# Altium project radxa_c200_io_board_v1.11.PrjPcb (part 7 of 8)

## Sheet 17_CAM_Connector.SchDoc: C200
size 594 x 420 mm; Page Create Date: March  8, 1995; Page Number: 17; Page Size: A2; Comment: radxa_1010; Page Count: 21; RevCode: V1.11; Doc: 17_CAM_Connector; DsnPath: D:\WMS\C200\CC122\对外\C200 V1.11.DSN; SchematicName: c200; PageName: 17_CAM_Connector; PageSize: A2; TopSchematic: True
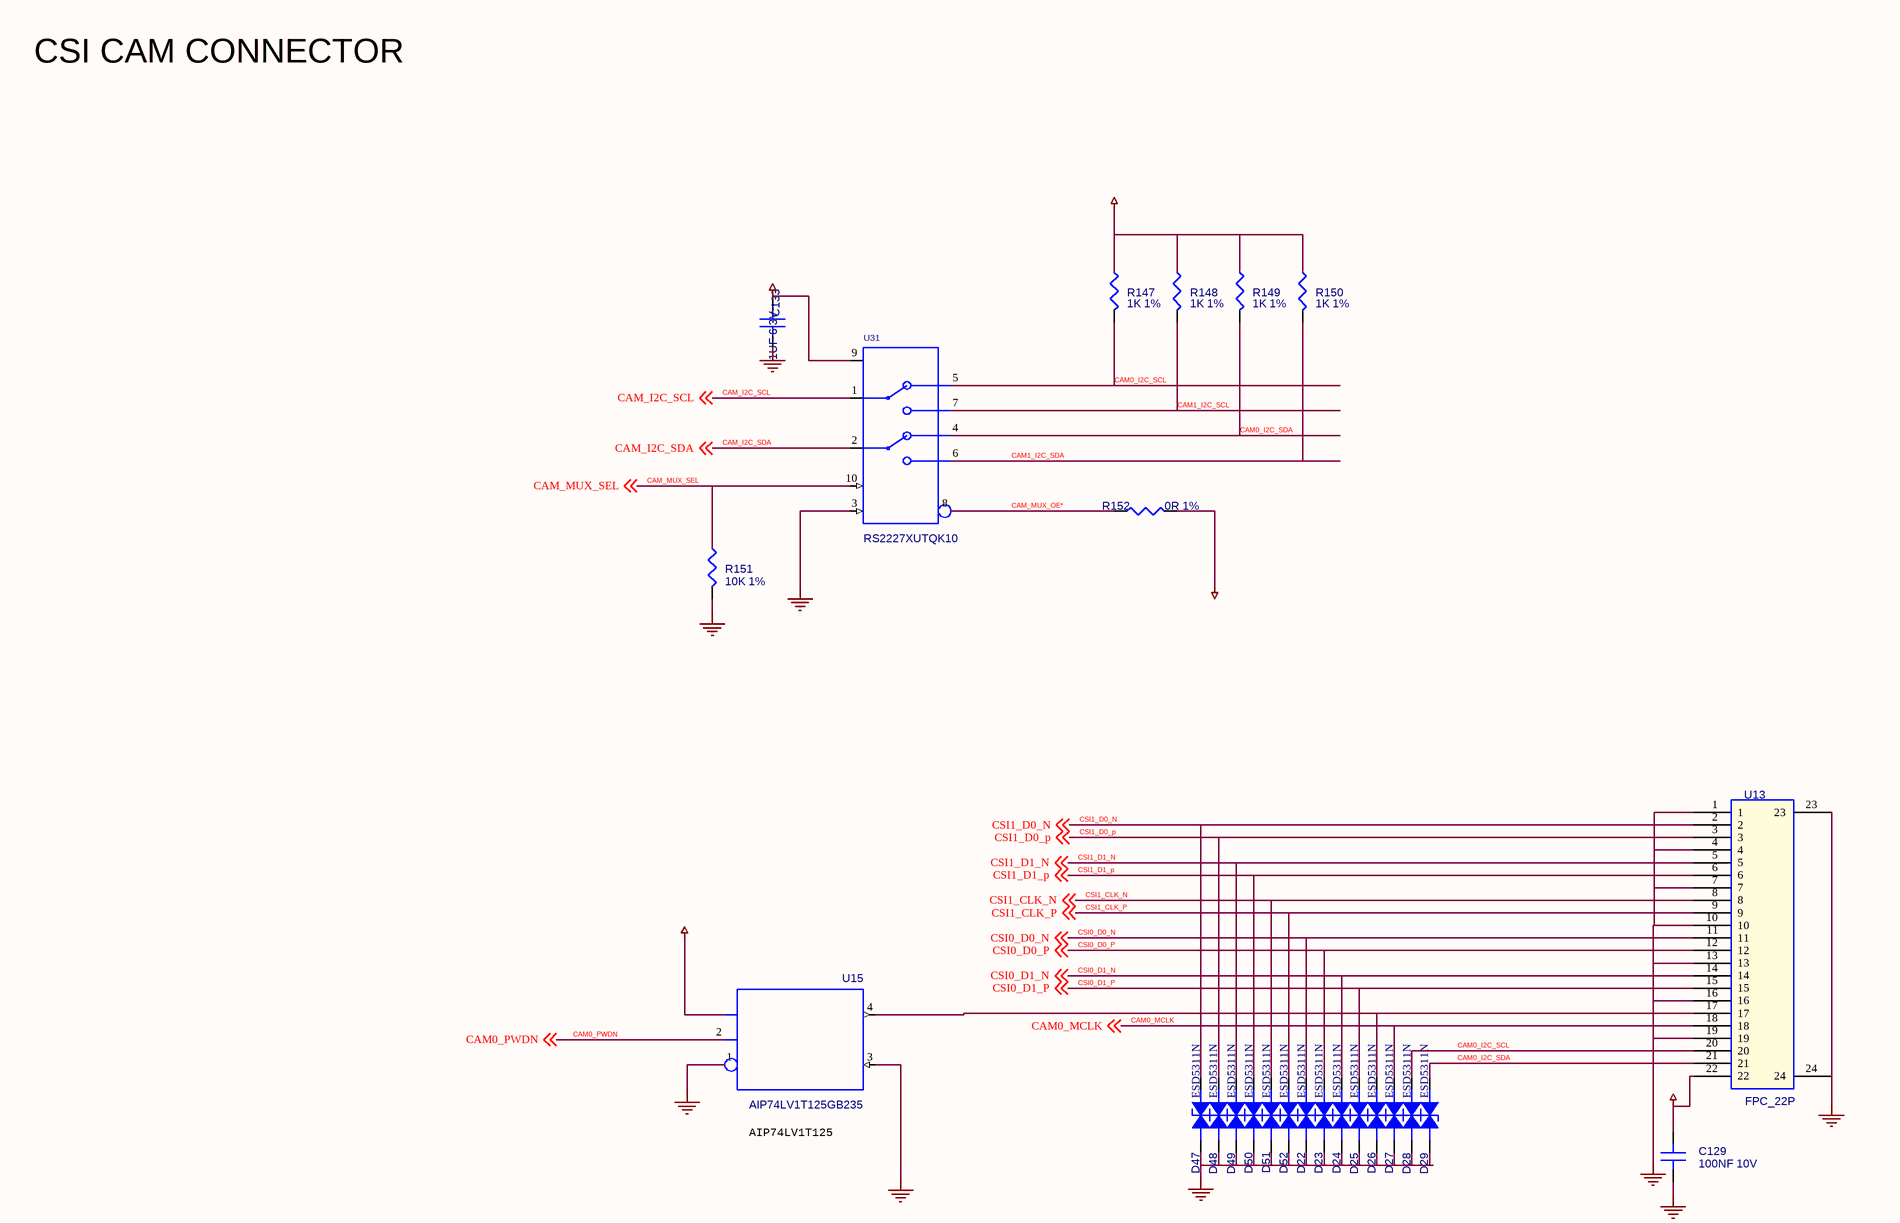
[diagram p34: 17_CAM_Connector.SchDoc, top left]
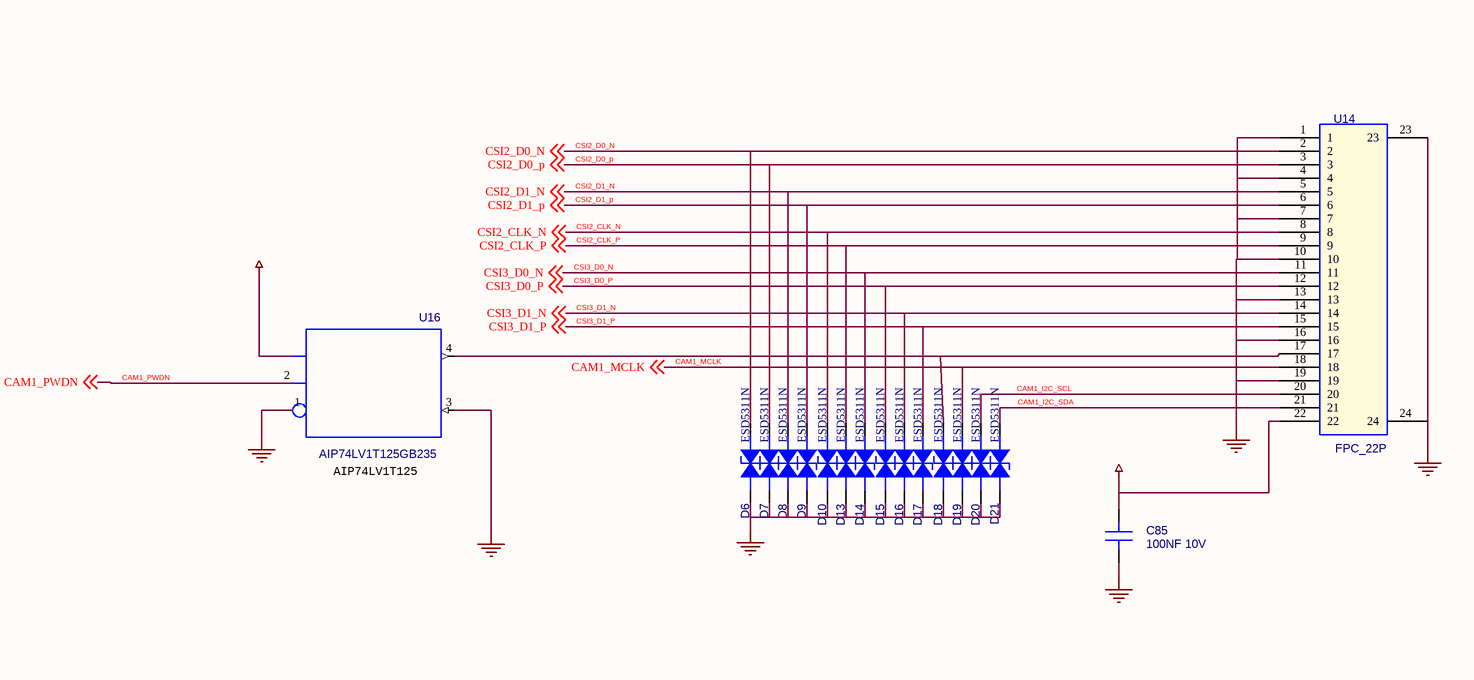
[diagram p35: 17_CAM_Connector.SchDoc, bottom left]
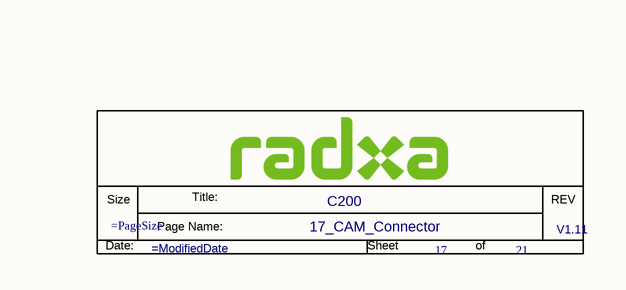
[diagram p36: 17_CAM_Connector.SchDoc, bottom right]

### Parts
(Parts that share a designator on the sheet are numbered #1, #2 ... from top to bottom, then left to right.)
*#16  Doc: 17_CAM_Connector  RevCode: V1.11  Title: C200  Page Number: 17  Page Count: 21  (hidden comment: radxa_1010)  (graphical)
C85  100NF 10V  [C0402]
C129  100NF 10V  [C0402]
C133  1UF 6.3V  [C0201]
D6  ESD5311N  [DFN1006-2L]
D7  ESD5311N  [DFN1006-2L]
D8  ESD5311N  [DFN1006-2L]
D9  ESD5311N  [DFN1006-2L]
D10  ESD5311N  [DFN1006-2L]
D13  ESD5311N  [DFN1006-2L]
D14  ESD5311N  [DFN1006-2L]
D15  ESD5311N  [DFN1006-2L]
D16  ESD5311N  [DFN1006-2L]
D17  ESD5311N  [DFN1006-2L]
D18  ESD5311N  [DFN1006-2L]
D19  ESD5311N  [DFN1006-2L]
D20  ESD5311N  [DFN1006-2L]
D21  ESD5311N  [DFN1006-2L]
D22  ESD5311N  [DFN1006-2L]
D23  ESD5311N  [DFN1006-2L]
D24  ESD5311N  [DFN1006-2L]
D25  ESD5311N  [DFN1006-2L]
D26  ESD5311N  [DFN1006-2L]
D27  ESD5311N  [DFN1006-2L]
D28  ESD5311N  [DFN1006-2L]
D29  ESD5311N  [DFN1006-2L]
D47  ESD5311N  [DFN1006-2L]
D48  ESD5311N  [DFN1006-2L]
D49  ESD5311N  [DFN1006-2L]
D50  ESD5311N  [DFN1006-2L]
D51  ESD5311N  [DFN1006-2L]
D52  ESD5311N  [DFN1006-2L]
R147  1K 1%  [R0402]
R148  1K 1%  [R0402]
R149  1K 1%  [R0402]
R150  1K 1%  [R0402]
R151  10K 1%  [R0402]
R152  0R 1%  [R0402]
U13  FPC_22P  [FPC_22_0D5_LIE_FG]
U14  FPC_22P  [FPC_22_0D5_LIE_FG]
U15  AIP74LV1T125GB235  [SC70_5]
U16  AIP74LV1T125GB235  [SC70_5]
U31  RS2227XUTQK10  [QFN10_0D4_1D4]

### Nets
GND: C85.2(B) C129.2(B) C133.2(B) D6.2(CATHODE) D7.2(CATHODE) D8.2(CATHODE) D9.2(CATHODE) D10.2(CATHODE) D13.2(CATHODE) D14.2(CATHODE) D15.2(CATHODE) D16.2(CATHODE) D17.2(CATHODE) D18.2(CATHODE) D19.2(CATHODE) D20.2(CATHODE) D21.2(CATHODE) D22.2(CATHODE) D23.2(CATHODE) D24.2(CATHODE) D25.2(CATHODE) D26.2(CATHODE) D27.2(CATHODE) D28.2(CATHODE) D29.2(CATHODE) D47.2(CATHODE) D48.2(CATHODE) D49.2(CATHODE) D50.2(CATHODE) D51.2(CATHODE) D52.2(CATHODE) R151.2 R152.2 U13.1 U13.4 U13.7 U13.10 U13.13 U13.16 U13.19 U13.23 U13.24 U14.1 U14.4 U14.7 U14.10 U14.13 U14.16 U14.19 U14.23 U14.24 U15.1(OE*) U15.3(GND) U16.1(OE*) U16.3(GND) U31.3(GND)  [project net HUB2_SSTX_N_J25]
VCC: U15.5(VCC) U16.5(VCC)
VDD_3V3_SYS: C85.1(A) C129.1(A) C133.1(A) R147.1 R148.1 R149.1 R150.1 U13.22 U14.22 U31.9(VCC)  [project net 3V3]
CAM0_I2C_SCL: D28.1(ANODE) R147.2 U13.20 U31.5(HSD1P)
CAM0_I2C_SDA: D29.1(ANODE) R149.2 U13.21 U31.4(HSD1N)
CAM0_MCLK: D27.1(ANODE) U13.18 ; off-sheet CAM0_MCLK
CAM0_PWDN: U15.2(IN) ; off-sheet CAM0_PWDN
CAM1_I2C_SCL: D20.1(ANODE) R148.2 U14.20 U31.7(HSD2P)
CAM1_I2C_SDA: D21.1(ANODE) R150.2 U14.21 U31.6(HSD2N)
CAM1_MCLK: D19.1(ANODE) U14.18 ; off-sheet CAM1_MCLK
CAM1_PWDN: U16.2(IN) ; off-sheet CAM1_PWDN
CAM_I2C_SCL: U31.1(DP) ; off-sheet CAM_I2C_SCL
CAM_I2C_SDA: U31.2(DN) ; off-sheet CAM_I2C_SDA
CAM_MUX_OE*: R152.1 U31.8(OE*)
CAM_MUX_SEL: R151.1 U31.10(S) ; off-sheet CAM_MUX_SEL
CSI0_D0_N: D22.1(ANODE) U13.11 ; off-sheet CSI0_D0_N
CSI0_D0_P: D23.1(ANODE) U13.12 ; off-sheet CSI0_D0_P
CSI0_D1_N: D24.1(ANODE) U13.14 ; off-sheet CSI0_D1_N
CSI0_D1_P: D25.1(ANODE) U13.15 ; off-sheet CSI0_D1_P
CSI1_CLK_N: D51.1(ANODE) U13.8 ; off-sheet CSI1_CLK_N
CSI1_CLK_P: D52.1(ANODE) U13.9 ; off-sheet CSI1_CLK_P
CSI1_D0_N: D47.1(ANODE) U13.2 ; off-sheet CSI1_D0_N
CSI1_D0_P: D48.1(ANODE) U13.3 ; off-sheet CSI1_D0_p
CSI1_D1_N: D49.1(ANODE) U13.5 ; off-sheet CSI1_D1_N
CSI1_D1_P: D50.1(ANODE) U13.6 ; off-sheet CSI1_D1_p
CSI2_CLK_N: D10.1(ANODE) U14.8 ; off-sheet CSI2_CLK_N
CSI2_CLK_P: D13.1(ANODE) U14.9 ; off-sheet CSI2_CLK_P
CSI2_D0_N: D6.1(ANODE) U14.2 ; off-sheet CSI2_D0_N
CSI2_D0_P: D7.1(ANODE) U14.3 ; off-sheet CSI2_D0_p
CSI2_D1_N: D8.1(ANODE) U14.5 ; off-sheet CSI2_D1_N
CSI2_D1_P: D9.1(ANODE) U14.6 ; off-sheet CSI2_D1_p
CSI3_D0_N: D14.1(ANODE) U14.11 ; off-sheet CSI3_D0_N
CSI3_D0_P: D15.1(ANODE) U14.12 ; off-sheet CSI3_D0_P
CSI3_D1_N: D16.1(ANODE) U14.14 ; off-sheet CSI3_D1_N
CSI3_D1_P: D17.1(ANODE) U14.15 ; off-sheet CSI3_D1_P
NetD18_1: D18.1(ANODE) U14.17 U16.4(OUT)
NetD26_1: D26.1(ANODE) U13.17 U15.4(OUT)

### Notes on the sheet
- CSI CAM CONNECTOR
- AIP74LV1T125
- (in symbol radxa_1010) Size; Title:; REV; Page Name:; Date:; Sheet; of

### Library data of the parts
C85 = C: SMD  0402  100NF  10V  X5R  ±10%  ROHS; PARTS: 1; Part Reference: C85; Part Number: A1C01.00163; OriginalSymbolOrigin: (0,30); PKG_TYPE: CAP2-100-250; LEVEL: STD; PINSWAP: (A,B); Value: 100NF 10V; Part Type: 陶瓷电容; PCB Footprint: C0402
C129 = C: SMD  0402  100NF  10V  X5R  ±10%  ROHS; PARTS: 1; Part Reference: C129; Part Number: A1C01.00163; OriginalSymbolOrigin: (0,30); PKG_TYPE: CAP2-100-250; LEVEL: STD; PINSWAP: (A,B); Value: 100NF 10V; Part Type: 陶瓷电容; PCB Footprint: C0402
C133 = C: SMD  0201  1UF  6.3V  X5R  ±20%  ROHS; PARTS: 1; Part Reference: C133; Part Number: A1C01.00083; OriginalSymbolOrigin: (0,30); PKG_TYPE: CAP2-100-250; LEVEL: STD; PINSWAP: (A,B); Value: 1UF 6.3V; Part Type: 陶瓷电容; PCB Footprint: C0201
D6 = ESD: SMD  编带  DFN1006-2L  ESD5311N-2/TR  双向TVS  VRWM=5V  0.25pF  84W  WILLSEMI(韦尔)  ROHS; Part Reference: D6; Part Number: A1D02.00001; Parameter: ESD-台舟 ESD5341N-封装 esd0402; Temp Coeff: -40℃ to +125℃; Value: ESD5311N; Part Type: 二极管-ESD管-桥堆-TVS管; PCB Footprint: DFN1006-2L
D7 = ESD: SMD  编带  DFN1006-2L  ESD5311N-2/TR  双向TVS  VRWM=5V  0.25pF  84W  WILLSEMI(韦尔)  ROHS; Part Reference: D7; Part Number: A1D02.00001; Parameter: ESD-台舟 ESD5341N-封装 esd0402; ID: DE-E0004; Temp Coeff: -40℃ to +125℃; Value: ESD5311N; Part Type: 二极管-ESD管-桥堆-TVS管; PCB Footprint: DFN1006-2L
D8 = ESD: SMD  编带  DFN1006-2L  ESD5311N-2/TR  双向TVS  VRWM=5V  0.25pF  84W  WILLSEMI(韦尔)  ROHS; Part Reference: D8; Part Number: A1D02.00001; Parameter: ESD-台舟 ESD5341N-封装 esd0402; ID: DE-E0004; Temp Coeff: -40℃ to +125℃; Value: ESD5311N; Part Type: 二极管-ESD管-桥堆-TVS管; PCB Footprint: DFN1006-2L
D9 = ESD: SMD  编带  DFN1006-2L  ESD5311N-2/TR  双向TVS  VRWM=5V  0.25pF  84W  WILLSEMI(韦尔)  ROHS; Part Reference: D9; Part Number: A1D02.00001; Parameter: ESD-台舟 ESD5341N-封装 esd0402; ID: DE-E0004; Temp Coeff: -40℃ to +125℃; Value: ESD5311N; Part Type: 二极管-ESD管-桥堆-TVS管; PCB Footprint: DFN1006-2L
D10 = ESD: SMD  编带  DFN1006-2L  ESD5311N-2/TR  双向TVS  VRWM=5V  0.25pF  84W  WILLSEMI(韦尔)  ROHS; Part Reference: D10; Part Number: A1D02.00001; Parameter: ESD-台舟 ESD5341N-封装 esd0402; Temp Coeff: -40℃ to +125℃; Value: ESD5311N; Part Type: 二极管-ESD管-桥堆-TVS管; PCB Footprint: DFN1006-2L
D13 = ESD: SMD  编带  DFN1006-2L  ESD5311N-2/TR  双向TVS  VRWM=5V  0.25pF  84W  WILLSEMI(韦尔)  ROHS; Part Reference: D13; Part Number: A1D02.00001; Parameter: ESD-台舟 ESD5341N-封装 esd0402; ID: DE-E0004; Temp Coeff: -40℃ to +125℃; Value: ESD5311N; Part Type: 二极管-ESD管-桥堆-TVS管; PCB Footprint: DFN1006-2L
D14 = ESD: SMD  编带  DFN1006-2L  ESD5311N-2/TR  双向TVS  VRWM=5V  0.25pF  84W  WILLSEMI(韦尔)  ROHS; Part Reference: D14; Part Number: A1D02.00001; Parameter: ESD-台舟 ESD5341N-封装 esd0402; ID: DE-E0004; Temp Coeff: -40℃ to +125℃; Value: ESD5311N; Part Type: 二极管-ESD管-桥堆-TVS管; PCB Footprint: DFN1006-2L
D15 = ESD: SMD  编带  DFN1006-2L  ESD5311N-2/TR  双向TVS  VRWM=5V  0.25pF  84W  WILLSEMI(韦尔)  ROHS; Part Reference: D15; Part Number: A1D02.00001; Parameter: ESD-台舟 ESD5341N-封装 esd0402; Temp Coeff: -40℃ to +125℃; Value: ESD5311N; Part Type: 二极管-ESD管-桥堆-TVS管; PCB Footprint: DFN1006-2L
D16 = ESD: SMD  编带  DFN1006-2L  ESD5311N-2/TR  双向TVS  VRWM=5V  0.25pF  84W  WILLSEMI(韦尔)  ROHS; Part Reference: D16; Part Number: A1D02.00001; Parameter: ESD-台舟 ESD5341N-封装 esd0402; ID: DE-E0004; Temp Coeff: -40℃ to +125℃; Value: ESD5311N; Part Type: 二极管-ESD管-桥堆-TVS管; PCB Footprint: DFN1006-2L
D17 = ESD: SMD  编带  DFN1006-2L  ESD5311N-2/TR  双向TVS  VRWM=5V  0.25pF  84W  WILLSEMI(韦尔)  ROHS; Part Reference: D17; Part Number: A1D02.00001; Parameter: ESD-台舟 ESD5341N-封装 esd0402; ID: DE-E0004; Temp Coeff: -40℃ to +125℃; Value: ESD5311N; Part Type: 二极管-ESD管-桥堆-TVS管; PCB Footprint: DFN1006-2L
D18 = ESD: SMD  编带  DFN1006-2L  ESD5311N-2/TR  双向TVS  VRWM=5V  0.25pF  84W  WILLSEMI(韦尔)  ROHS; Part Reference: D18; Part Number: A1D02.00001; Parameter: ESD-台舟 ESD5341N-封装 esd0402; Temp Coeff: -40℃ to +125℃; Value: ESD5311N; Part Type: 二极管-ESD管-桥堆-TVS管; PCB Footprint: DFN1006-2L
D19 = ESD: SMD  编带  DFN1006-2L  ESD5311N-2/TR  双向TVS  VRWM=5V  0.25pF  84W  WILLSEMI(韦尔)  ROHS; Part Reference: D19; Part Number: A1D02.00001; Parameter: ESD-台舟 ESD5341N-封装 esd0402; ID: DE-E0004; Temp Coeff: -40℃ to +125℃; Value: ESD5311N; Part Type: 二极管-ESD管-桥堆-TVS管; PCB Footprint: DFN1006-2L
D20 = ESD: SMD  编带  DFN1006-2L  ESD5311N-2/TR  双向TVS  VRWM=5V  0.25pF  84W  WILLSEMI(韦尔)  ROHS; Part Reference: D20; Part Number: A1D02.00001; Parameter: ESD-台舟 ESD5341N-封装 esd0402; Temp Coeff: -40℃ to +125℃; Value: ESD5311N; Part Type: 二极管-ESD管-桥堆-TVS管; PCB Footprint: DFN1006-2L
D21 = ESD: SMD  编带  DFN1006-2L  ESD5311N-2/TR  双向TVS  VRWM=5V  0.25pF  84W  WILLSEMI(韦尔)  ROHS; Part Reference: D21; Part Number: A1D02.00001; Parameter: ESD-台舟 ESD5341N-封装 esd0402; ID: DE-E0004; Temp Coeff: -40℃ to +125℃; Value: ESD5311N; Part Type: 二极管-ESD管-桥堆-TVS管; PCB Footprint: DFN1006-2L
D22 = ESD: SMD  编带  DFN1006-2L  ESD5311N-2/TR  双向TVS  VRWM=5V  0.25pF  84W  WILLSEMI(韦尔)  ROHS; Part Reference: D22; Part Number: A1D02.00001; Parameter: ESD-台舟 ESD5341N-封装 esd0402; Temp Coeff: -40℃ to +125℃; Value: ESD5311N; Part Type: 二极管-ESD管-桥堆-TVS管; PCB Footprint: DFN1006-2L
D23 = ESD: SMD  编带  DFN1006-2L  ESD5311N-2/TR  双向TVS  VRWM=5V  0.25pF  84W  WILLSEMI(韦尔)  ROHS; Part Reference: D23; Part Number: A1D02.00001; Parameter: ESD-台舟 ESD5341N-封装 esd0402; ID: DE-E0004; Temp Coeff: -40℃ to +125℃; Value: ESD5311N; Part Type: 二极管-ESD管-桥堆-TVS管; PCB Footprint: DFN1006-2L
D24 = ESD: SMD  编带  DFN1006-2L  ESD5311N-2/TR  双向TVS  VRWM=5V  0.25pF  84W  WILLSEMI(韦尔)  ROHS; Part Reference: D24; Part Number: A1D02.00001; Parameter: ESD-台舟 ESD5341N-封装 esd0402; ID: DE-E0004; Temp Coeff: -40℃ to +125℃; Value: ESD5311N; Part Type: 二极管-ESD管-桥堆-TVS管; PCB Footprint: DFN1006-2L
D25 = ESD: SMD  编带  DFN1006-2L  ESD5311N-2/TR  双向TVS  VRWM=5V  0.25pF  84W  WILLSEMI(韦尔)  ROHS; Part Reference: D25; Part Number: A1D02.00001; Parameter: ESD-台舟 ESD5341N-封装 esd0402; ID: DE-E0004; Temp Coeff: -40℃ to +125℃; Value: ESD5311N; Part Type: 二极管-ESD管-桥堆-TVS管; PCB Footprint: DFN1006-2L
D26 = ESD: SMD  编带  DFN1006-2L  ESD5311N-2/TR  双向TVS  VRWM=5V  0.25pF  84W  WILLSEMI(韦尔)  ROHS; Part Reference: D26; Part Number: A1D02.00001; Parameter: ESD-台舟 ESD5341N-封装 esd0402; Temp Coeff: -40℃ to +125℃; Value: ESD5311N; Part Type: 二极管-ESD管-桥堆-TVS管; PCB Footprint: DFN1006-2L
D27 = ESD: SMD  编带  DFN1006-2L  ESD5311N-2/TR  双向TVS  VRWM=5V  0.25pF  84W  WILLSEMI(韦尔)  ROHS; Part Reference: D27; Part Number: A1D02.00001; Parameter: ESD-台舟 ESD5341N-封装 esd0402; ID: DE-E0004; Temp Coeff: -40℃ to +125℃; Value: ESD5311N; Part Type: 二极管-ESD管-桥堆-TVS管; PCB Footprint: DFN1006-2L
D28 = ESD: SMD  编带  DFN1006-2L  ESD5311N-2/TR  双向TVS  VRWM=5V  0.25pF  84W  WILLSEMI(韦尔)  ROHS; Part Reference: D28; Part Number: A1D02.00001; Parameter: ESD-台舟 ESD5341N-封装 esd0402; Temp Coeff: -40℃ to +125℃; Value: ESD5311N; Part Type: 二极管-ESD管-桥堆-TVS管; PCB Footprint: DFN1006-2L
D29 = ESD: SMD  编带  DFN1006-2L  ESD5311N-2/TR  双向TVS  VRWM=5V  0.25pF  84W  WILLSEMI(韦尔)  ROHS; Part Reference: D29; Part Number: A1D02.00001; Parameter: ESD-台舟 ESD5341N-封装 esd0402; ID: DE-E0004; Temp Coeff: -40℃ to +125℃; Value: ESD5311N; Part Type: 二极管-ESD管-桥堆-TVS管; PCB Footprint: DFN1006-2L
D47 = ESD: SMD  编带  DFN1006-2L  ESD5311N-2/TR  双向TVS  VRWM=5V  0.25pF  84W  WILLSEMI(韦尔)  ROHS; Part Reference: D47; Part Number: A1D02.00001; Parameter: ESD-台舟 ESD5341N-封装 esd0402; Temp Coeff: -40℃ to +125℃; Value: ESD5311N; Part Type: 二极管-ESD管-桥堆-TVS管; PCB Footprint: DFN1006-2L
D48 = ESD: SMD  编带  DFN1006-2L  ESD5311N-2/TR  双向TVS  VRWM=5V  0.25pF  84W  WILLSEMI(韦尔)  ROHS; Part Reference: D48; Part Number: A1D02.00001; Parameter: ESD-台舟 ESD5341N-封装 esd0402; ID: DE-E0004; Temp Coeff: -40℃ to +125℃; Value: ESD5311N; Part Type: 二极管-ESD管-桥堆-TVS管; PCB Footprint: DFN1006-2L
D49 = ESD: SMD  编带  DFN1006-2L  ESD5311N-2/TR  双向TVS  VRWM=5V  0.25pF  84W  WILLSEMI(韦尔)  ROHS; Part Reference: D49; Part Number: A1D02.00001; Parameter: ESD-台舟 ESD5341N-封装 esd0402; ID: DE-E0004; Temp Coeff: -40℃ to +125℃; Value: ESD5311N; Part Type: 二极管-ESD管-桥堆-TVS管; PCB Footprint: DFN1006-2L
D50 = ESD: SMD  编带  DFN1006-2L  ESD5311N-2/TR  双向TVS  VRWM=5V  0.25pF  84W  WILLSEMI(韦尔)  ROHS; Part Reference: D50; Part Number: A1D02.00001; Parameter: ESD-台舟 ESD5341N-封装 esd0402; ID: DE-E0004; Temp Coeff: -40℃ to +125℃; Value: ESD5311N; Part Type: 二极管-ESD管-桥堆-TVS管; PCB Footprint: DFN1006-2L
D51 = ESD: SMD  编带  DFN1006-2L  ESD5311N-2/TR  双向TVS  VRWM=5V  0.25pF  84W  WILLSEMI(韦尔)  ROHS; Part Reference: D51; Part Number: A1D02.00001; Parameter: ESD-台舟 ESD5341N-封装 esd0402; Temp Coeff: -40℃ to +125℃; Value: ESD5311N; Part Type: 二极管-ESD管-桥堆-TVS管; PCB Footprint: DFN1006-2L
D52 = ESD: SMD  编带  DFN1006-2L  ESD5311N-2/TR  双向TVS  VRWM=5V  0.25pF  84W  WILLSEMI(韦尔)  ROHS; Part Reference: D52; Part Number: A1D02.00001; Parameter: ESD-台舟 ESD5341N-封装 esd0402; ID: DE-E0004; Temp Coeff: -40℃ to +125℃; Value: ESD5311N; Part Type: 二极管-ESD管-桥堆-TVS管; PCB Footprint: DFN1006-2L
R147 = R: SMD  0201  1K  1/20W  ±1%  ROHS; Part Reference: R147; Part Number: A1R01.00111; CDS_PART_NAME: R_0402-47K,5 %,62.5MW,195-0599-000; CDS_PHYS_PART_NAME: R_0402-47K,5 %,62.5MW,195-0599-000-195-0599-000,47K; PCB Footprint: R0201; ASSEMBLY: CAM; CDS_LIB: discrete; CDS_SEC: 1; DEVICE_TYPENAME: R_0402-47K5625MW195-0599-000-195-0599-00047K; DRAWING: @P3449_B01_LIB.P3449_B01(SCH_1):PAGE18; MAX_WATTAGE: 62.5mW; NV_PN: 195-0599-000; PACK_TYPE: 402; PATH: I86; PHYS_PAGE: 18; ROT: 0; SIGNAL_MODEL: nv_res; TOL: 5%; VER: 2; XY: (-9200,2300); Value: 1K 1%; Part Type: 贴片电阻; CHIPS_PART_NAME: R; SEC: 1
R148 = R: SMD  0201  1K  1/20W  ±1%  ROHS; Part Reference: R148; CDS_PHYS_PART_NAME: R_0402-47K,5 %,62.5MW,195-0599-000-195-0599-000,47K; CDS_PART_NAME: R_0402-47K,5 %,62.5MW,195-0599-000; Part Number: A1R01.00111; PCB Footprint: R0201; SEC: 1; XY: (-8950,2300); VER: 2; TOL: 5%; SIGNAL_MODEL: nv_res; ROT: 0; PHYS_PAGE: 18; PATH: I87; PACK_TYPE: 402; NV_PN: 195-0599-000; MAX_WATTAGE: 62.5mW; DRAWING: @P3449_B01_LIB.P3449_B01(SCH_1):PAGE18; DEVICE_TYPENAME: R_0402-47K5625MW195-0599-000-195-0599-00047K; CDS_LIB: discrete; ASSEMBLY: CAM; Value: 1K 1%; CHIPS_PART_NAME: R; CDS_SEC: 1; Part Type: 贴片电阻
R149 = R: SMD  0201  1K  1/20W  ±1%  ROHS; Part Reference: R149; CDS_PHYS_PART_NAME: R_0402-47K,5 %,62.5MW,195-0599-000-195-0599-000,47K; CDS_PART_NAME: R_0402-47K,5 %,62.5MW,195-0599-000; Part Number: A1R01.00111; PCB Footprint: R0201; SEC: 1; XY: (-8700,2300); VER: 2; TOL: 5%; SIGNAL_MODEL: nv_res; ROT: 0; PHYS_PAGE: 18; PATH: I88; PACK_TYPE: 402; NV_PN: 195-0599-000; MAX_WATTAGE: 62.5mW; DRAWING: @P3449_B01_LIB.P3449_B01(SCH_1):PAGE18; DEVICE_TYPENAME: R_0402-47K5625MW195-0599-000-195-0599-00047K; CDS_LIB: discrete; ASSEMBLY: CAM; Value: 1K 1%; CHIPS_PART_NAME: R; CDS_SEC: 1; Part Type: 贴片电阻
R150 = R: SMD  0201  1K  1/20W  ±1%  ROHS; Part Reference: R150; CDS_PHYS_PART_NAME: R_0402-47K,5 %,62.5MW,195-0599-000-195-0599-000,47K; CDS_PART_NAME: R_0402-47K,5 %,62.5MW,195-0599-000; Part Number: A1R01.00111; PCB Footprint: R0201; SEC: 1; XY: (-8450,2300); VER: 2; TOL: 5%; SIGNAL_MODEL: nv_res; ROT: 0; PHYS_PAGE: 18; PATH: I89; PACK_TYPE: 402; NV_PN: 195-0599-000; MAX_WATTAGE: 62.5mW; DRAWING: @P3449_B01_LIB.P3449_B01(SCH_1):PAGE18; DEVICE_TYPENAME: R_0402-47K5625MW195-0599-000-195-0599-00047K; CDS_LIB: discrete; ASSEMBLY: CAM; Value: 1K 1%; CHIPS_PART_NAME: R; CDS_SEC: 1; Part Type: 贴片电阻
R151 = R: SMD  0402  10K  1/16W  ±1%  ROHS; Part Reference: R151; Part Number: A1R01.00222; CDS_PART_NAME: R_0402-10K,5 %,62.5MW,195-0486-000; CDS_PHYS_PART_NAME: R_0402-10K,5 %,62.5MW,195-0486-000-10K,195-0486-000; ASSEMBLY: CAM; CDS_LIB: discrete; CDS_SEC: 1; DEVICE_TYPENAME: R_0402-10K5625MW195-0486-000-10K195-0486-000; DRAWING: @P3449_B01_LIB.P3449_B01(SCH_1):PAGE18; MAX_WATTAGE: 62.5mW; NV_PN: 195-0486-000; PACK_TYPE: 402; PATH: I92; PHYS_PAGE: 18; ROT: 0; SIGNAL_MODEL: nv_res; TOL: 5%; VER: 2; XY: (-10850,1350); PCB Footprint: R0402; Value: 10K 1%; Part Type: 贴片电阻; CHIPS_PART_NAME: R; SEC: 1
R152 = R: SMD  0402  0R  1/16W  ±1%  ROHS; Part Reference: R152; Part Number: A1R01.00219; PCB Footprint: R0402; Value: 0R 1%; Part Type: 贴片电阻
U13 = FPC_22P: Part Reference: U13; PCB Footprint: FPC_22_0D5_LIE; Value: FPC_22P
U14 = FPC_22P: Part Reference: U14; PCB Footprint: FPC_22_0D5_LIE; Value: FPC_22P
U15 = 74LVC1G125GW_125: SMD  缓冲器/驱动器  AIP74LV1T125GB235.TR  SOT23-5  I-CORE(中微爱芯)  ROHS; Part Reference: U15; Part Number: A1I01.01025; OriginalSymbolOrigin: (-300,200); Preferred: 优选; ASSEMBLY: ?; FUNCTION: ?; NV_NAME: ?; NV_PN: ?; PACK_TYPE: ?; PATH: ?; PLACEMENT_NOTE: ?; SKU: COMMON; Value: AIP74LV1T125GB235; Part Type: 集成电路/模块; PCB Footprint: SC70_5
U16 = 74LVC1G125GW_125: SMD  缓冲器/驱动器  AIP74LV1T125GB235.TR  SOT23-5  I-CORE(中微爱芯)  ROHS; Part Reference: U16; Part Number: A1I01.01025; OriginalSymbolOrigin: (-300,200); Preferred: 优选; ASSEMBLY: ?; FUNCTION: ?; NV_NAME: ?; NV_PN: ?; PACK_TYPE: ?; PATH: ?; PLACEMENT_NOTE: ?; SKU: COMMON; Value: AIP74LV1T125GB235; Part Type: 集成电路/模块; PCB Footprint: SC70_5
U31 = RS2227XUTQK10: SMD  模拟开关/多路复用器  RS2227XUTQK10  QFN-1.4x1.8-10L  RUNIC(润石)  ROHS; Part Reference: U31; Part Number: A1I01.00774; SYM4PACK_TYPE: UQFN10; OriginalSymbolOrigin: (-200,350); Temp Coeff: -40°C to +85°C; ASSEMBLY: ?; FUNCTION: ?; NV_NAME: ?; NV_PN: ?; PACK_TYPE: ?; PATH: ?; PLACEMENT_NOTE: ?; SKU: COMMON; Value: RS2227XUTQK10; Part Type: 集成电路/模块; PCB Footprint: QFN10_0D4_1D4
*#16 = radxa_1010: Page Create Date: March  8, 1995; Page Size: =PageSize; Page Modify Date: =ModifiedDate

## Sheet 18_40Pin_GPIO_expansion_heade.SchDoc: C200
size 439 x 311 mm; Page Create Date: March  8, 1995; Page Number: 18; Page Size: Custom; Comment: radxa_1010; Page Count: 21; RevCode: V1.11; Doc: 18_40Pin_GPIO_expansion_heade; DsnPath: D:\WMS\C200\CC122\对外\C200 V1.11.DSN; SchematicName: c200; PageName: 18_40Pin_GPIO_expansion_heade; PageSize: Custom; TopSchematic: True
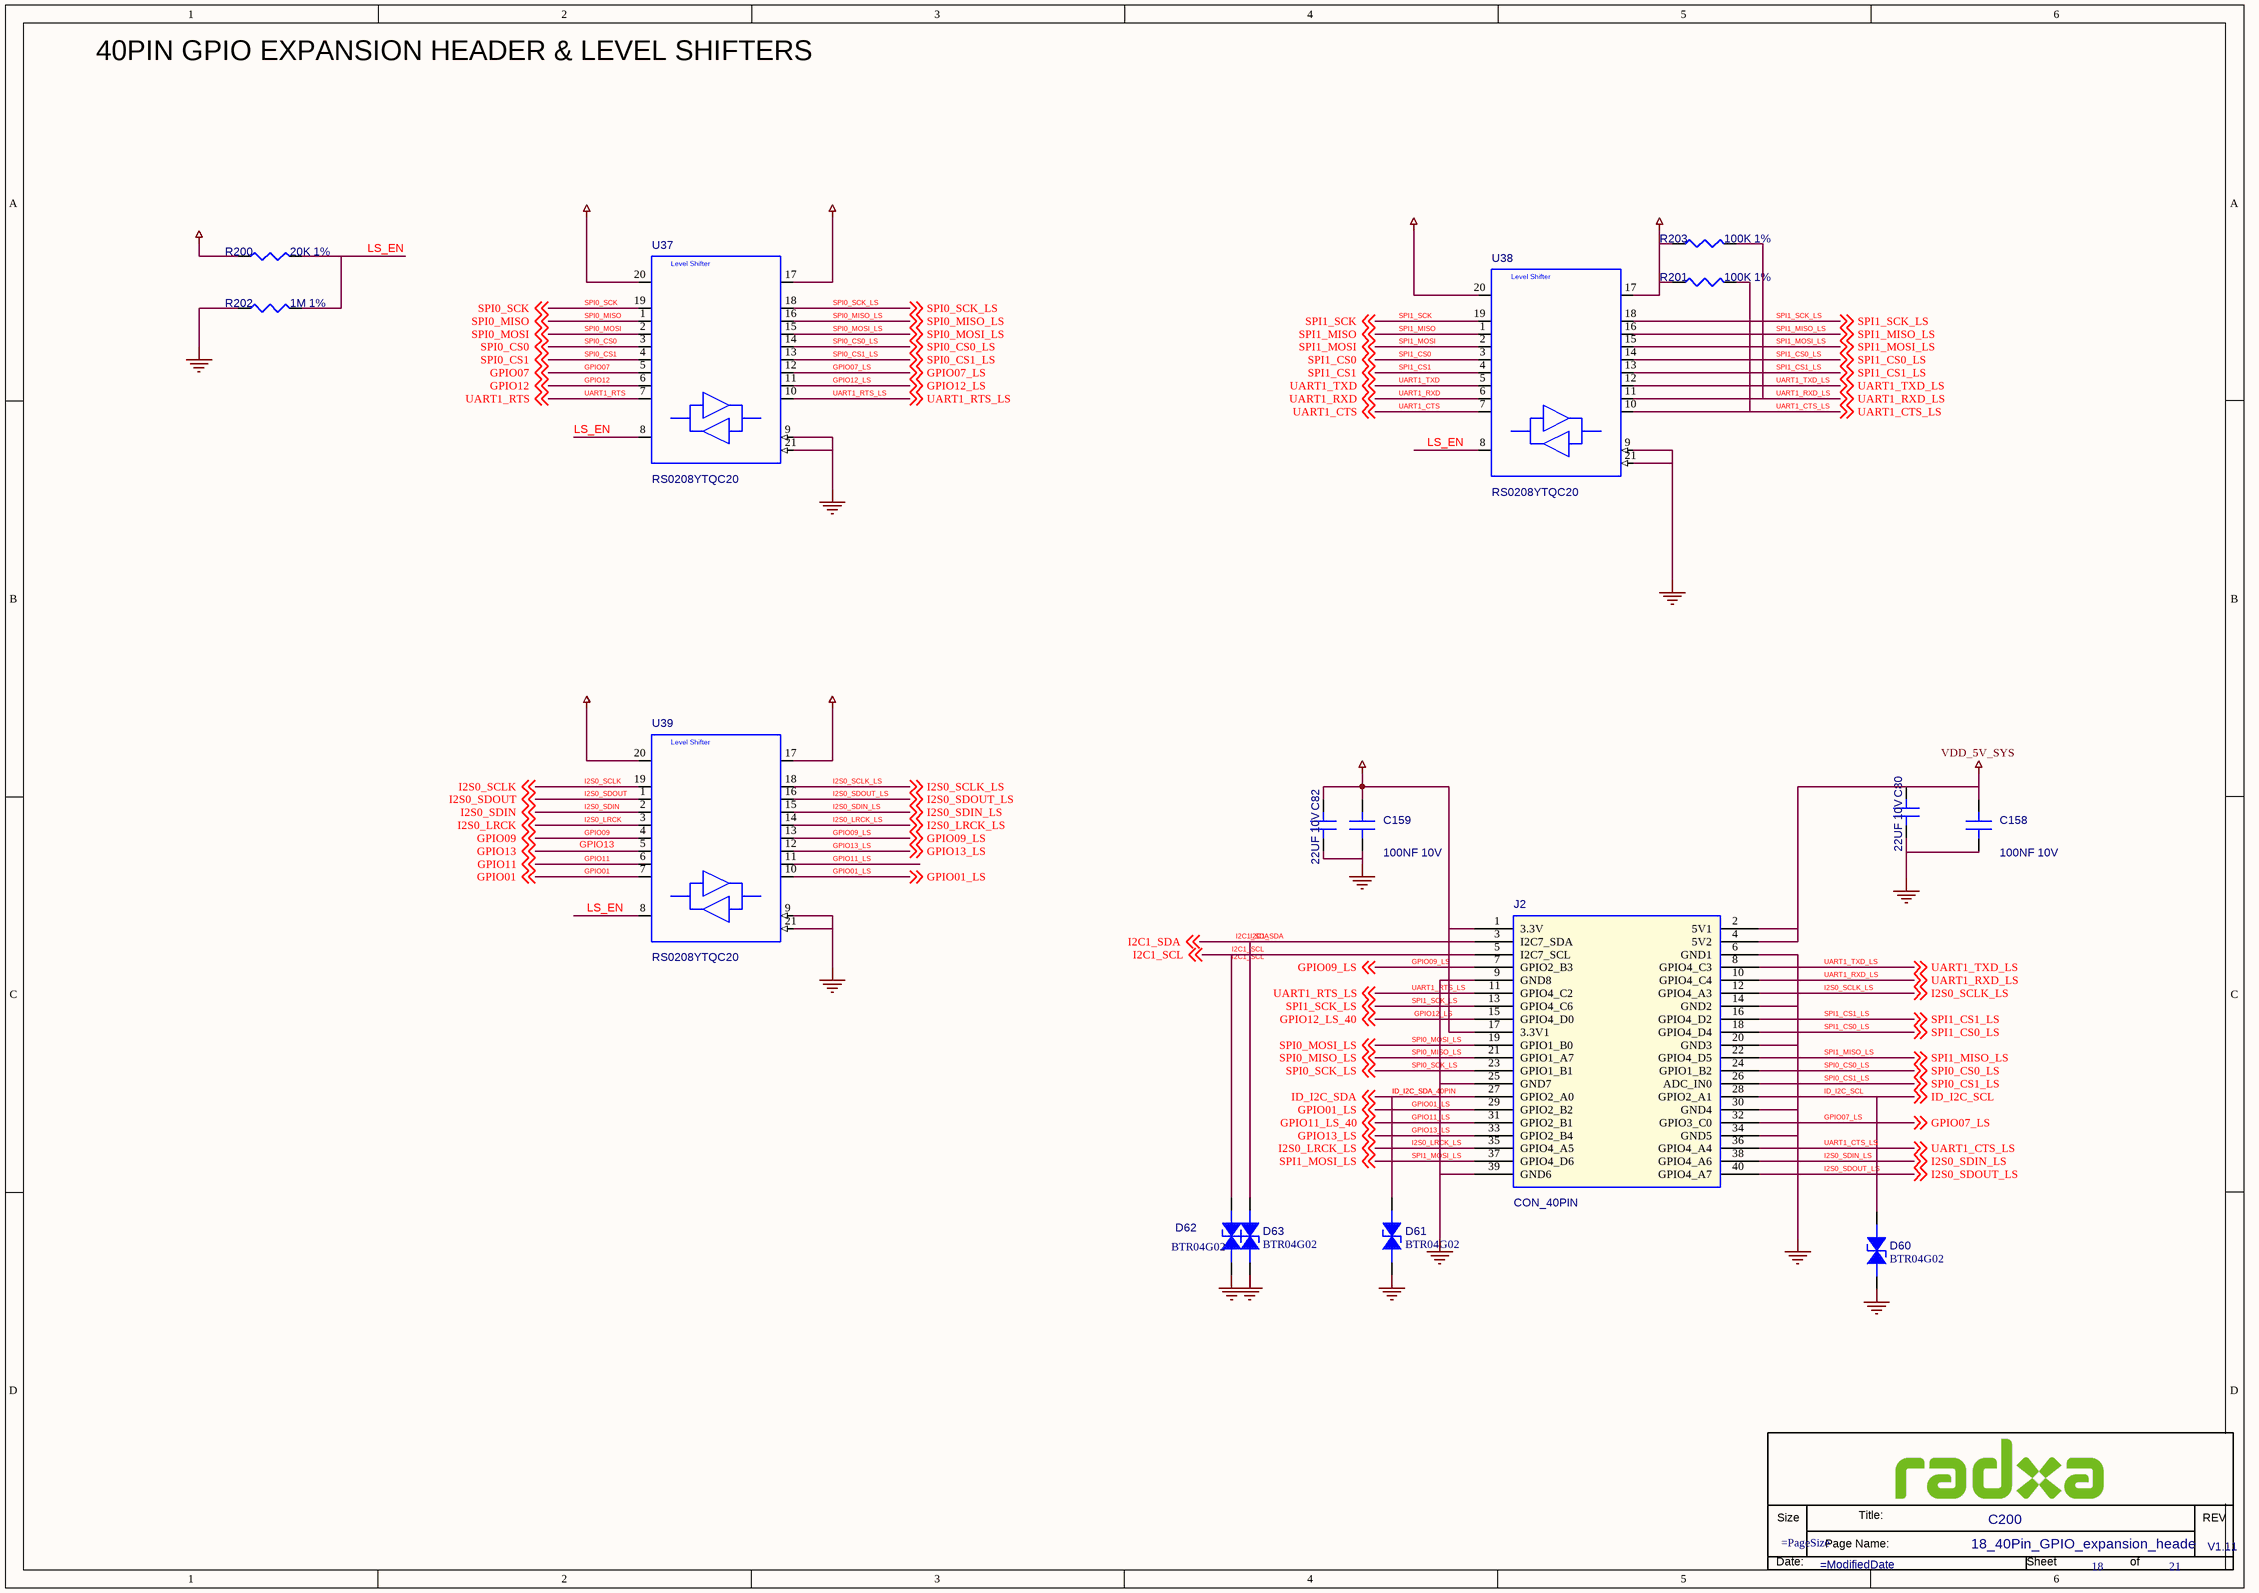
[diagram p37: 18_40Pin_GPIO_expansion_heade.SchDoc]

### Parts
(Parts that share a designator on the sheet are numbered #1, #2 ... from top to bottom, then left to right.)
*#17  Doc: 18_40Pin_GPIO_expansion_heade  RevCode: V1.11  Title: C200  Page Number: 18  Page Count: 21  (hidden comment: radxa_1010)  (graphical)
C80  22UF 10V  [C0603]
C82  22UF 10V  [C0603]
C158  100NF 10V  [C0402]
C159  100NF 10V  [C0402]
D60  BTR04G02  [DFN1006-2L]
D61  BTR04G02  [DFN1006-2L]
D62  BTR04G02  [DFN1006-2L]
D63  BTR04G02  [DFN1006-2L]
J2  CON_40PIN  [CON_TH20X2_2D54_STA]
R200  20K 1%  [R0402]
R201  100K 1%  [R0402]
R202  1M 1%  [R0402]
R203  100K 1%  [R0402]
U37  RS0208YTQC20  [QFN20_0D4_3]
U38  RS0208YTQC20  [QFN20_0D4_3]
U39  RS0208YTQC20  [QFN20_0D4_3]

### Nets
GND: C80.2(B) C82.2(B) C158.2(B) C159.2(B) D60.1(ANODE) D61.1(ANODE) D62.1(ANODE) D63.1(ANODE) J2.6(GND1) J2.9(GND8) J2.14(GND2) J2.20(GND3) J2.25(GND7) J2.30(GND4) J2.34(GND5) J2.39(GND6) R202.1 U37.9(GND) U37.21(EP) U38.9(GND) U38.21(EP) U39.9(GND) U39.21(EP)  [project net HUB2_SSTX_N_J25]
VDD_1V8: R200.1 U37.20(VCCA) U38.20(VCCA) U39.20(VCCA)
VDD_3V3_SYS: C82.1(A) C159.1(A) J2.1(3.3V) J2.17(3.3V1) R201.1 R203.1 U37.17(VCCB) U38.17(VCCB) U39.17(VCCB)  [project net 3V3]
VDD_5V_SYS: C80.1(A) C158.1(A) J2.2(5V1) J2.4(5V2)  [project net PC_LED+]
GPIO01: U39.7(A8) ; off-sheet GPIO01
GPIO01_LS: J2.29(GPIO2_B2) U39.10(B8) ; off-sheet GPIO01_LS
GPIO07: U37.5(A6) ; off-sheet GPIO07
GPIO07_LS: J2.32(GPIO3_C0) U37.12(B6) ; off-sheet GPIO07_LS
GPIO09: U39.4(A5) ; off-sheet GPIO09
GPIO09_LS: J2.7(GPIO2_B3) U39.13(B5) ; off-sheet GPIO09_LS
GPIO11: U39.6(A7) ; off-sheet GPIO11
GPIO11_LS: J2.31(GPIO2_B1) U39.11(B7) ; off-sheet GPIO11_LS_40  [also labelled GPIO11_LS_40]
GPIO12: U37.6(A7) ; off-sheet GPIO12
GPIO12_LS: J2.15(GPIO4_D0) U37.11(B7) ; off-sheet GPIO12_LS, off-sheet GPIO12_LS_40  [also labelled GPIO12_LS_40]
GPIO13: U39.5(A6) ; off-sheet GPIO13
GPIO13_LS: J2.33(GPIO2_B4) U39.12(B6) ; off-sheet GPIO13_LS
I2C1_SCL: D62.2(CATHODE) J2.5(I2C7_SCL) ; off-sheet I2C1_SCL
I2C1_SDA: D63.2(CATHODE) J2.3(I2C7_SDA) ; off-sheet I2C1_SDA
I2S0_LRCK: U39.3(A4) ; off-sheet I2S0_LRCK
I2S0_LRCK_LS: J2.35(GPIO4_A5) U39.14(B4) ; off-sheet I2S0_LRCK_LS
I2S0_SCLK: U39.19(A1) ; off-sheet I2S0_SCLK
I2S0_SCLK_LS: J2.12(GPIO4_A3) U39.18(B1) ; off-sheet I2S0_SCLK_LS
I2S0_SDIN: U39.2(A3) ; off-sheet I2S0_SDIN
I2S0_SDIN_LS: J2.38(GPIO4_A6) U39.15(B3) ; off-sheet I2S0_SDIN_LS
I2S0_SDOUT: U39.1(A2) ; off-sheet I2S0_SDOUT
I2S0_SDOUT_LS: J2.40(GPIO4_A7) U39.16(B2) ; off-sheet I2S0_SDOUT_LS
ID_I2C_SCL: D60.2(CATHODE) J2.28(GPIO2_A1) ; off-sheet ID_I2C_SCL
ID_I2C_SDA: D61.2(CATHODE) J2.27(GPIO2_A0) ; off-sheet ID_I2C_SDA  [also labelled ID_I2C_SDA_40PIN]
LS_EN: R200.2 R202.2 U37.8(OE) U38.8(OE) U39.8(OE)
SPI0_CS0: U37.3(A4) ; off-sheet SPI0_CS0
SPI0_CS0_LS: J2.24(GPIO1_B2) U37.14(B4) ; off-sheet SPI0_CS0_LS
SPI0_CS1: U37.4(A5) ; off-sheet SPI0_CS1
SPI0_CS1_LS: J2.26(ADC_IN0) U37.13(B5) ; off-sheet SPI0_CS1_LS
SPI0_MISO: U37.1(A2) ; off-sheet SPI0_MISO
SPI0_MISO_LS: J2.21(GPIO1_A7) U37.16(B2) ; off-sheet SPI0_MISO_LS
SPI0_MOSI: U37.2(A3) ; off-sheet SPI0_MOSI
SPI0_MOSI_LS: J2.19(GPIO1_B0) U37.15(B3) ; off-sheet SPI0_MOSI_LS
SPI0_SCK: U37.19(A1) ; off-sheet SPI0_SCK
SPI0_SCK_LS: J2.23(GPIO1_B1) U37.18(B1) ; off-sheet SPI0_SCK_LS
SPI1_CS0: U38.3(A4) ; off-sheet SPI1_CS0
SPI1_CS0_LS: J2.18(GPIO4_D4) U38.14(B4) ; off-sheet SPI1_CS0_LS
SPI1_CS1: U38.4(A5) ; off-sheet SPI1_CS1
SPI1_CS1_LS: J2.16(GPIO4_D2) U38.13(B5) ; off-sheet SPI1_CS1_LS
SPI1_MISO: U38.1(A2) ; off-sheet SPI1_MISO
SPI1_MISO_LS: J2.22(GPIO4_D5) U38.16(B2) ; off-sheet SPI1_MISO_LS
SPI1_MOSI: U38.2(A3) ; off-sheet SPI1_MOSI
SPI1_MOSI_LS: J2.37(GPIO4_D6) U38.15(B3) ; off-sheet SPI1_MOSI_LS
SPI1_SCK: U38.19(A1) ; off-sheet SPI1_SCK
SPI1_SCK_LS: J2.13(GPIO4_C6) U38.18(B1) ; off-sheet SPI1_SCK_LS
UART1_CTS: U38.7(A8) ; off-sheet UART1_CTS
UART1_CTS_LS: J2.36(GPIO4_A4) R201.2 U38.10(B8) ; off-sheet UART1_CTS_LS
UART1_RTS: U37.7(A8) ; off-sheet UART1_RTS
UART1_RTS_LS: J2.11(GPIO4_C2) U37.10(B8) ; off-sheet UART1_RTS_LS
UART1_RXD: U38.6(A7) ; off-sheet UART1_RXD
UART1_RXD_LS: J2.10(GPIO4_C4) R203.2 U38.11(B7) ; off-sheet UART1_RXD_LS
UART1_TXD: U38.5(A6) ; off-sheet UART1_TXD
UART1_TXD_LS: J2.8(GPIO4_C3) U38.12(B6) ; off-sheet UART1_TXD_LS

### Notes on the sheet
- 40PIN GPIO EXPANSION HEADER & LEVEL SHIFTERS
- (in symbol radxa_1010) Size; Title:; REV; Page Name:; Date:; Sheet; of
- (in symbol RS0208) Level Shifter

### Library data of the parts
C80 = C: SMD  0603  22UF  10V  X5R  ±20%  ROHS; PARTS: 1; Part Reference: C80; Part Number: A1C01.00015; OriginalSymbolOrigin: (0,30); PKG_TYPE: CAP2-100-250; LEVEL: STD; PINSWAP: (A,B); Value: 22UF 10V; Part Type: 陶瓷电容; PCB Footprint: C0603
C82 = C: SMD  0603  22UF  10V  X5R  ±20%  ROHS; PARTS: 1; Part Reference: C82; Part Number: A1C01.00015; OriginalSymbolOrigin: (0,30); PKG_TYPE: CAP2-100-250; LEVEL: STD; PINSWAP: (A,B); Value: 22UF 10V; Part Type: 陶瓷电容; PCB Footprint: C0603
C158 = C: SMD  0402  100NF  10V  X5R  ±10%  ROHS; PARTS: 1; Part Reference: C158; Part Number: A1C01.00163; OriginalSymbolOrigin: (0,30); PKG_TYPE: CAP2-100-250; LEVEL: STD; PINSWAP: (A,B); Value: 100NF 10V; Part Type: 陶瓷电容; PCB Footprint: C0402
C159 = C: SMD  0402  100NF  10V  X5R  ±10%  ROHS; PARTS: 1; Part Reference: C159; Part Number: A1C01.00163; OriginalSymbolOrigin: (0,30); PKG_TYPE: CAP2-100-250; LEVEL: STD; PINSWAP: (A,B); Value: 100NF 10V; Part Type: 陶瓷电容; PCB Footprint: C0402
D60 = ESD: SMD  编带  0402  BTR04G02  B-tron  ROHS; Part Reference: D60; Part Number: A1D02.00002; Parameter: ESD-台舟 ESD5341N-封装 esd0402; ID: DE-E0004; Temp Coeff: -50℃ ~ +125℃; PCB Footprint: ESD_D0402; Value: BTR04G02; Part Type: 二极管-ESD管-桥堆-TVS管
D61 = ESD: SMD  编带  0402  BTR04G02  B-tron  ROHS; Part Reference: D61; Part Number: A1D02.00002; Parameter: ESD-台舟 ESD5341N-封装 esd0402; ID: DE-E0004; Temp Coeff: -50℃ ~ +125℃; PCB Footprint: ESD_D0402; Value: BTR04G02; Part Type: 二极管-ESD管-桥堆-TVS管
D62 = ESD: SMD  编带  0402  BTR04G02  B-tron  ROHS; Part Reference: D62; Part Number: A1D02.00002; Parameter: ESD-台舟 ESD5341N-封装 esd0402; ID: DE-E0004; Temp Coeff: -50℃ ~ +125℃; PCB Footprint: ESD_D0402; Value: BTR04G02; Part Type: 二极管-ESD管-桥堆-TVS管
D63 = ESD: SMD  编带  0402  BTR04G02  B-tron  ROHS; Part Reference: D63; Part Number: A1D02.00002; Parameter: ESD-台舟 ESD5341N-封装 esd0402; ID: DE-E0004; Temp Coeff: -50℃ ~ +125℃; PCB Footprint: ESD_D0402; Value: BTR04G02; Part Type: 二极管-ESD管-桥堆-TVS管
J2 = CON_SM2X20: DIP  排针座  2*20PIN  180度  2.54mm脚距  中间朔高2.5mm  针长一端6.1mm  另一端3mm  彩色  PH2.54  2*20P  彩印 L=11.6/3.0  国意英  ROHS; Part Reference: J2; Part Number: A1J01.00012; Value: CON_40PIN; Part Type: 排座; PCB Footprint: CON_TH20X2_2D54_STA
R200 = R: SMD  0402  20K  1/16W  ±1%  ROHS; Part Reference: R200; Part Number: A1R01.00360; PCB Footprint: R0402; Value: 20K 1%; Part Type: 贴片电阻
R201 = R: SMD  0402  100K  1/16W  ±1%  ROHS; Part Reference: R201; Part Number: A1R01.00031; Temp Coeff: －55℃ ~ ＋155℃; PCB Footprint: R0402; Value: 100K 1%; Part Type: 贴片电阻
R202 = R: SMD  0402  1M  1/16W  ±1%  ROHS; Part Reference: R202; Part Number: A1R01.00454; PCB Footprint: R0402; Value: 1M 1%; Part Type: 贴片电阻
R203 = R: SMD  0402  100K  1/16W  ±1%  ROHS; Part Reference: R203; Part Number: A1R01.00031; Temp Coeff: －55℃ ~ ＋155℃; PCB Footprint: R0402; Value: 100K 1%; Part Type: 贴片电阻
U37 = RS0208: SMD  转换器/电平移位器  RS0208YTQC20  QFN3*3-20L  RUNIC(润石)  ROHS; Part Reference: U37; Part Number: A1I01.00775; OriginalSymbolOrigin: (-250,350); CDS_LMAN_SYM_OUTLINE: -250,350,250,-450; Temp Coeff: -40°C to +85°C; SKU: COMMON; PLACEMENT_NOTE: ?; PATH: ?; PACK_TYPE: ?; NV_PN: ?; NV_NAME: ?; FUNCTION: ?; ASSEMBLY: ?; Value: RS0208YTQC20; Part Type: 集成电路/模块; PCB Footprint: QFN20_0D4_3
U38 = RS0208: SMD  转换器/电平移位器  RS0208YTQC20  QFN3*3-20L  RUNIC(润石)  ROHS; Part Reference: U38; Part Number: A1I01.00775; OriginalSymbolOrigin: (-250,350); CDS_LMAN_SYM_OUTLINE: -250,350,250,-450; Temp Coeff: -40°C to +85°C; SKU: COMMON; PLACEMENT_NOTE: ?; PATH: ?; PACK_TYPE: ?; NV_PN: ?; NV_NAME: ?; FUNCTION: ?; ASSEMBLY: ?; Value: RS0208YTQC20; Part Type: 集成电路/模块; PCB Footprint: QFN20_0D4_3
U39 = RS0208: SMD  转换器/电平移位器  RS0208YTQC20  QFN3*3-20L  RUNIC(润石)  ROHS; Part Reference: U39; Part Number: A1I01.00775; OriginalSymbolOrigin: (-250,350); CDS_LMAN_SYM_OUTLINE: -250,350,250,-450; Temp Coeff: -40°C to +85°C; SKU: COMMON; PLACEMENT_NOTE: ?; PATH: ?; PACK_TYPE: ?; NV_PN: ?; NV_NAME: ?; FUNCTION: ?; ASSEMBLY: ?; Value: RS0208YTQC20; Part Type: 集成电路/模块; PCB Footprint: QFN20_0D4_3
*#17 = radxa_1010: Page Create Date: March  8, 1995; Page Size: =PageSize; Page Modify Date: =ModifiedDate

## Sheet 19_KEY_M_X4.SchDoc: C200
size 439 x 311 mm; Page Create Date: March  8, 1995; Page Number: 19; Page Size: Custom; Comment: radxa_1010; Page Count: 21; RevCode: V1.11; Doc: 19_KEY_M_X4; DsnPath: D:\WMS\C200\CC122\对外\C200 V1.11.DSN; SchematicName: c200; PageName: 19_KEY_M_X4; PageSize: Custom; TopSchematic: True
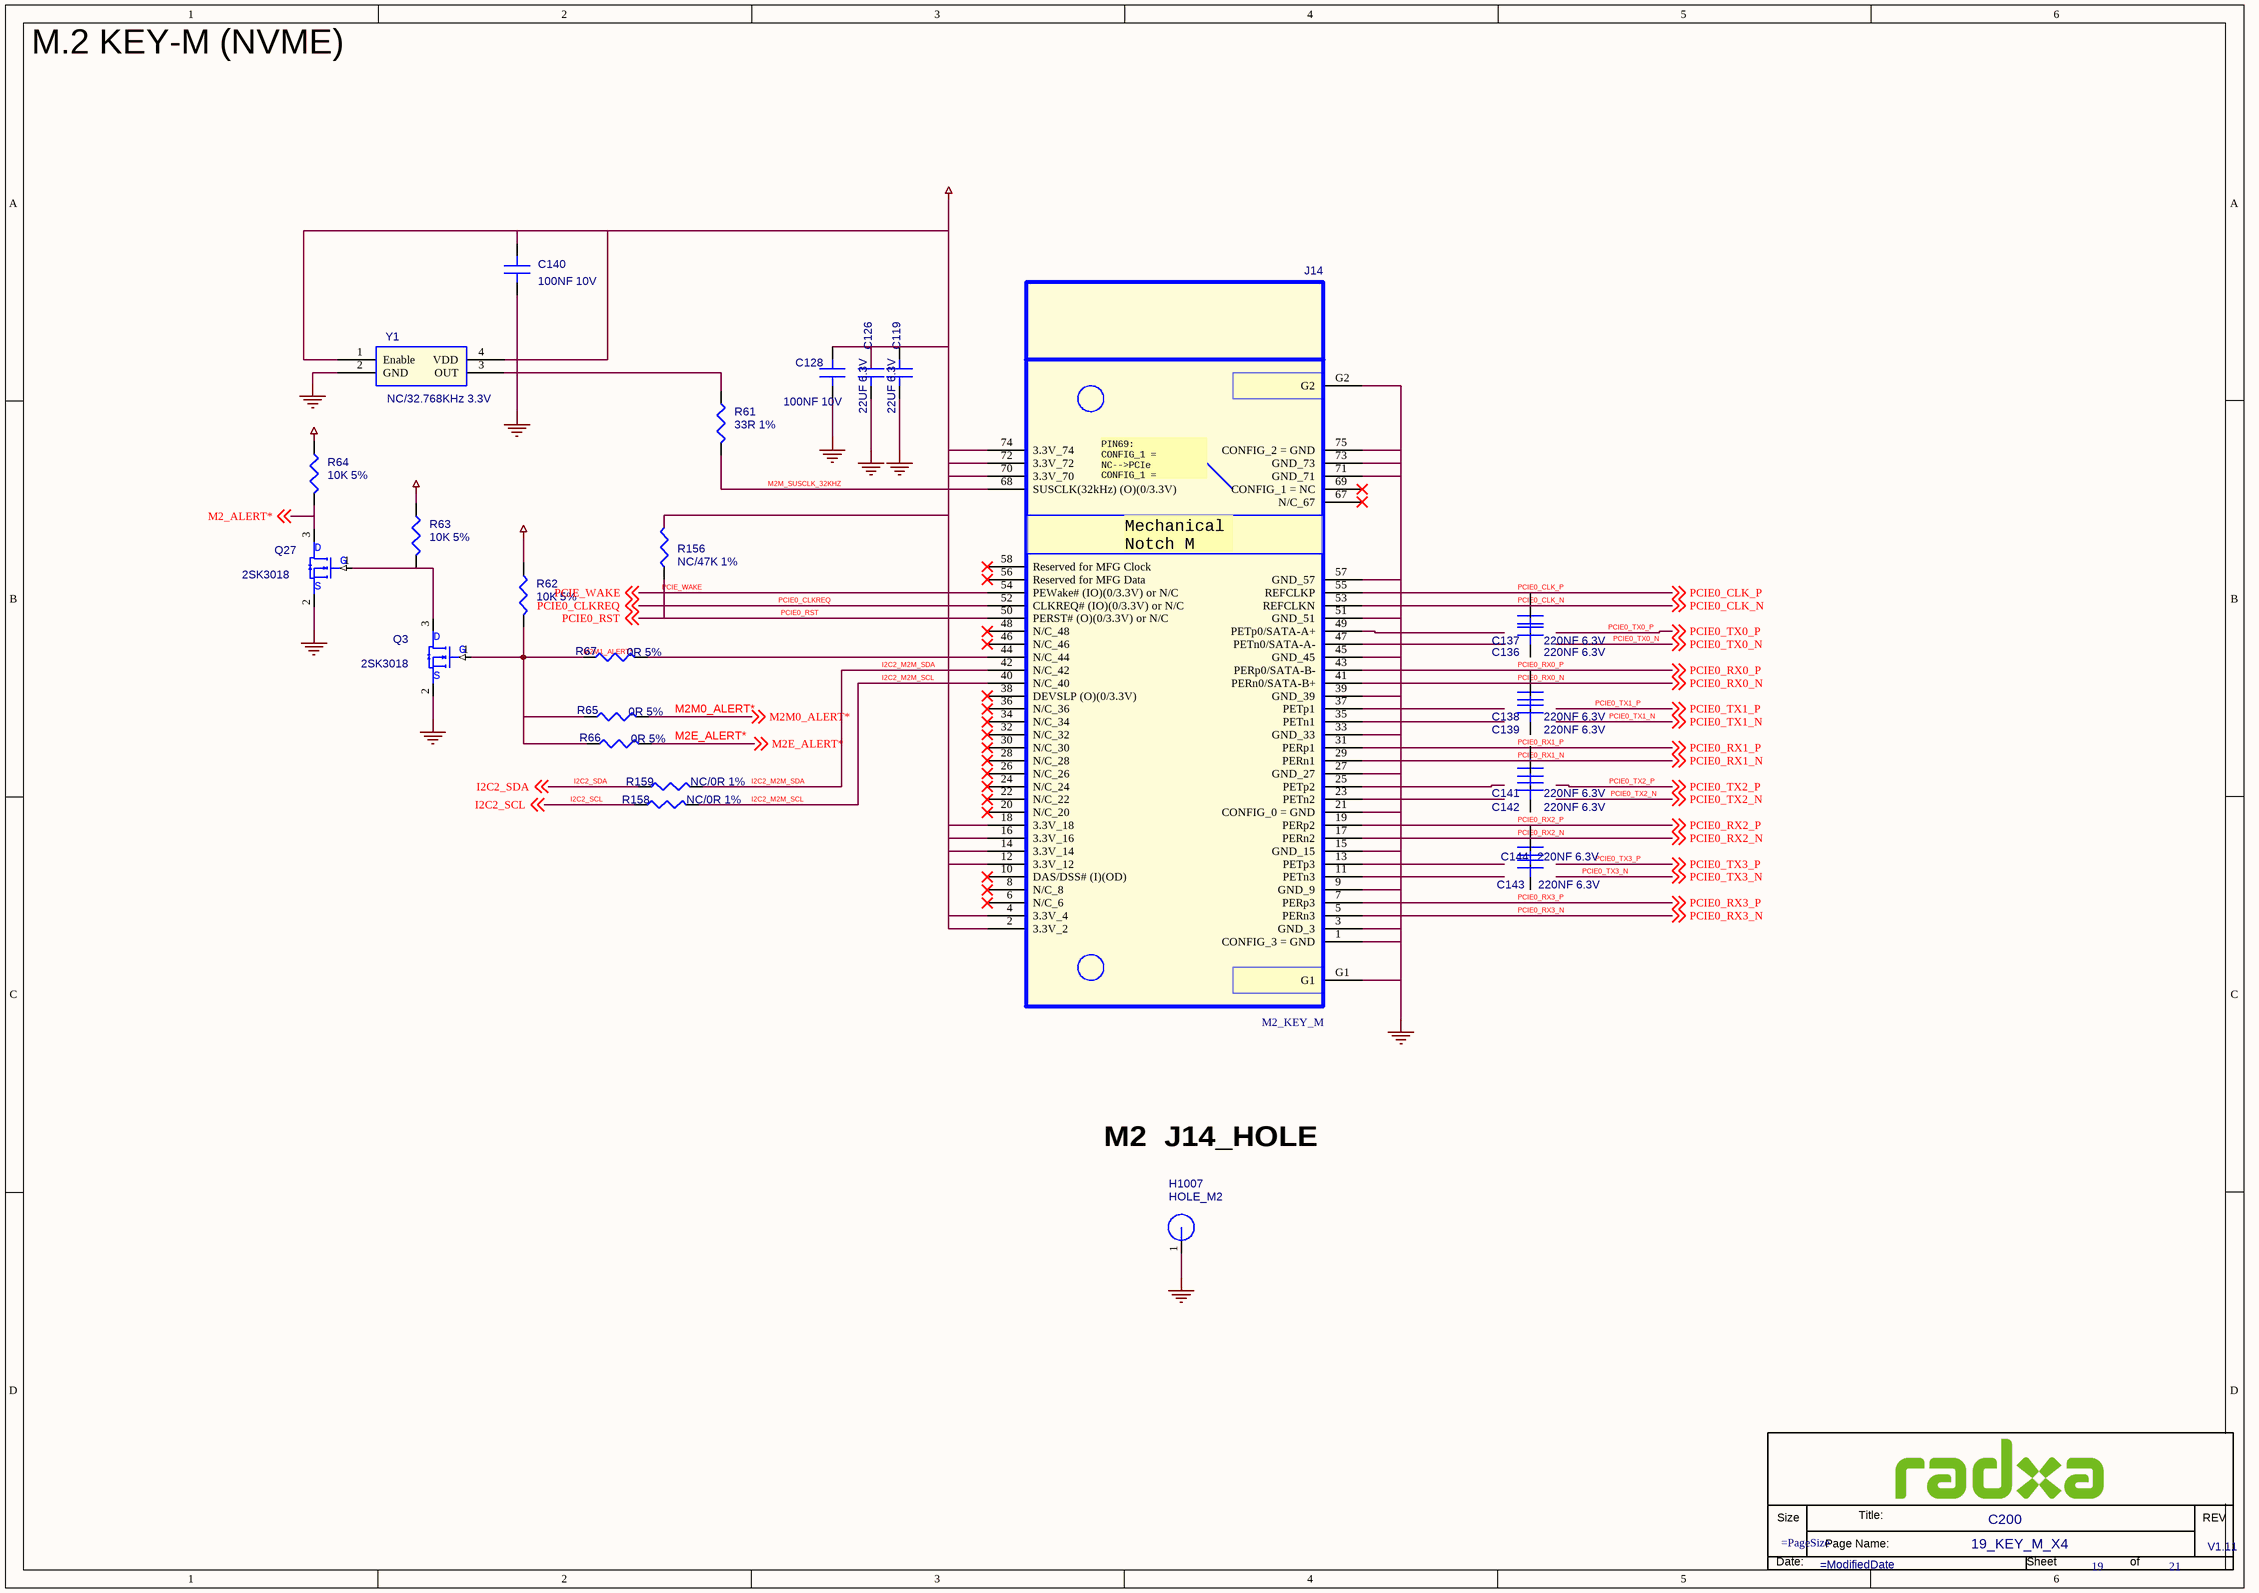
[diagram p38: 19_KEY_M_X4.SchDoc]

### Parts
(Parts that share a designator on the sheet are numbered #1, #2 ... from top to bottom, then left to right.)
*#18  Doc: 19_KEY_M_X4  RevCode: V1.11  Title: C200  Page Number: 19  Page Count: 21  (hidden comment: radxa_1010)  (graphical)
C119  22UF 6.3V  [C0603]
C126  22UF 6.3V  [C0603]
C128  100NF 10V  [C0402]
C136  220NF 6.3V  [C0201]
C137  220NF 6.3V  [C0201]
C138  220NF 6.3V  [C0201]
C139  220NF 6.3V  [C0201]
C140  100NF 10V  [C0402]
C141  220NF 6.3V  [C0201]
C142  220NF 6.3V  [C0201]
C143  220NF 6.3V  [C0201]
C144  220NF 6.3V  [C0201]
H1007  HOLE_M2  [H3.8MM]
J14  M2_KEY_M  [M2-M_KEY_SM_75_0D5]
Q3  2SK3018  [SOT_323]
Q27  2SK3018  [SOT_323]
R61  33R 1%  [R0402]
R62  10K 5%  [R0402]
R63  10K 5%  [R0402]
R64  10K 5%  [R0402]
R65  0R 5%  [R0402]
R66  0R 5%  [R0402]
R67  0R 5%  [R0402]
R156  NC/47K 1%  [R0402]
R158  NC/0R 1%  [R0402]
R159  NC/0R 1%  [R0402]
Y1  NC/32.768KHz 3.3V  [Y-4-5_08-TXC-7W5]

### Nets
GND: C119.2(B) C126.2(B) C128.2(B) C140.2(B) H1007.1 J14.1(CONFIG_3_=_GND) J14.3(GND_3) J14.9(GND_9) J14.15(GND_15) J14.21(CONFIG_0_=_GND) J14.27(GND_27) J14.33(GND_33) J14.39(GND_39) J14.45(GND_45) J14.51(GND_51) J14.57(GND_57) J14.71(GND_71) J14.73(GND_73) J14.75(CONFIG_2_=_GND) J14.G1 J14.G2 Q3.2(S) Q27.2(S) Y1.2(GND)  [project net HUB2_SSTX_N_J25]
MKEY_3V3: C119.1(A) C126.1(A) C128.1(A) C140.1(A) J14.2(3.3V_2) J14.4(3.3V_4) J14.12(3.3V_12) J14.14(3.3V_14) J14.16(3.3V_16) J14.18(3.3V_18) J14.70(3.3V_70) J14.72(3.3V_72) J14.74(3.3V_74) R156.1 Y1.1(Enable) Y1.4(VDD)
VDD_1V8: R62.1 R63.1 R64.1
I2C2_M2M_SCL: J14.40(N/C_40) R158.2
I2C2_M2M_SDA: J14.42(N/C_42) R159.2
I2C2_SCL: R158.1 ; off-sheet I2C2_SCL
I2C2_SDA: R159.1 ; off-sheet I2C2_SDA
M2_ALERT*: Q27.3(D) R64.2 ; off-sheet M2_ALERT*
M2E_ALERT*: R66.2 ; off-sheet M2E_ALERT*
M2M0_ALERT*: R65.2 ; off-sheet M2M0_ALERT*
M2M1_ALERT*: Q3.1(G) R62.2 R65.1 R66.1 R67.1
M2M_SUSCLK_32KHZ: J14.68(SUSCLK(32kHz)_(O)(0/3.3V)) R61.2
PCIE0_CLK_N: C136.1(A) J14.53(REFCLKN) ; off-sheet PCIE0_CLK_N
PCIE0_CLK_P: J14.55(REFCLKP) ; off-sheet PCIE0_CLK_P
PCIE0_CLKREQ: J14.52(CLKREQ#_(IO)(0/3.3V)_or_N/C) ; off-sheet PCIE0_CLKREQ
PCIE0_RST: J14.50(PERST#_(O)(0/3.3V)_or_N/C) R156.2 ; off-sheet PCIE0_RST
PCIE0_RX0_N: C139.1(A) J14.41(PERn0/SATA-B+) ; off-sheet PCIE0_RX0_N
PCIE0_RX0_P: C138.1(A) J14.43(PERp0/SATA-B-) ; off-sheet PCIE0_RX0_P
PCIE0_RX1_N: C142.1(A) J14.29(PERn1) ; off-sheet PCIE0_RX1_N
PCIE0_RX1_P: J14.31(PERp1) ; off-sheet PCIE0_RX1_P
PCIE0_RX2_N: C143.1(A) J14.17(PERn2) ; off-sheet PCIE0_RX2_N
PCIE0_RX2_P: C144.1(A) J14.19(PERp2) ; off-sheet PCIE0_RX2_P
PCIE0_RX3_N: J14.5(PERn3) ; off-sheet PCIE0_RX3_N
PCIE0_RX3_P: J14.7(PERp3) ; off-sheet PCIE0_RX3_P
PCIE_WAKE: J14.54(PEWake#_(IO)(0/3.3V)_or_N/C) ; off-sheet PCIE_WAKE
NetJ14_44: J14.44(N/C_44) R67.2
NetQ3_3: Q3.3(D) Q27.1(G) R63.2
NetR61_1: R61.1 Y1.3(OUT)

Not connected (* = marked no-connect by the designer): C136 2(B); C137 1(A) 2(B); C138 2(B); C139 2(B); C141 1(A) 2(B); C142 2(B); C143 2(B); C144 2(B); J14 6(N/C_6)* 8(N/C_8)* 10(DAS/DSS#_(I)(OD))* 11(PETn3) 13(PETp3) 20(N/C_20)* 22(N/C_22)* 23(PETn2) 24(N/C_24)* 25(PETp2) 26(N/C_26)* 28(N/C_28)* 30(N/C_30)* 32(N/C_32)* 34(N/C_34)* 35(PETn1) 36(N/C_36)* 37(PETp1) 38(DEVSLP_(O)(0/3.3V))* 46(N/C_46)* 47(PETn0/SATA-A-) 48(N/C_48)* 49(PETp0/SATA-A+) 56(Reserved_for_MFG_Data)* 58(Reserved_for_MFG_Clock)* 67(N/C_67)* 69(CONFIG_1_=_NC)*

### Notes on the sheet
- M.2 KEY-M (NVME)
- M2  J14_HOLE
- (in symbol M2_KEY_M) PIN69: / CONFIG_1 = NC-->PCIe / CONFIG_1 = / GND-->SATA; Mechanical / Notch M
- (in symbol radxa_1010) Size; Title:; REV; Page Name:; Date:; Sheet; of

### Library data of the parts
C119 = C: SMD  0603  22UF  6.3V  X5R  ±20%  ROHS; PARTS: 1; Part Reference: C119; Part Number: A1C01.00004; OriginalSymbolOrigin: (0,30); PKG_TYPE: CAP2-100-250; LEVEL: STD; PINSWAP: (A,B); Value: 22UF 6.3V; Part Type: 陶瓷电容; PCB Footprint: C0603
C126 = C: SMD  0603  22UF  6.3V  X5R  ±20%  ROHS; PARTS: 1; Part Reference: C126; Part Number: A1C01.00004; OriginalSymbolOrigin: (0,30); PKG_TYPE: CAP2-100-250; LEVEL: STD; PINSWAP: (A,B); Value: 22UF 6.3V; Part Type: 陶瓷电容; PCB Footprint: C0603
C128 = C: SMD  0402  100NF  10V  X5R  ±10%  ROHS; PARTS: 1; Part Reference: C128; Part Number: A1C01.00163; OriginalSymbolOrigin: (0,30); PKG_TYPE: CAP2-100-250; LEVEL: STD; PINSWAP: (A,B); Value: 100NF 10V; Part Type: 陶瓷电容; PCB Footprint: C0402
C136 = C: SMD  0201  220NF  6.3V  X5R  ±20%  ROHS; PARTS: 1; Part Reference: C136; CDS_PART_NAME: C_0402-0.22UF,X5R,10%,6.3V,039-0011-000; CDS_PHYS_PART_NAME: C_0402-0.22UF,X5R,10%,6.3V,039-0011-000-0.22UF,039-0011-000; Part Number: A1C01.00128; OriginalSymbolOrigin: (0,30); PKG_TYPE: CAP2-100-250; LEVEL: STD; PINSWAP: (A,B); ASSEMBLY: M2_NVME; CDS_LIB: discrete; DEVICE_TYPENAME: C_0402-022UFX5R1063V039-0011-000-022UF039-0011-000; DRAWING: #NAME?; NV_PN: 039-0011-000; PACK_TYPE: 402; PATH: I8; PHYS_PAGE: 21; ROT: 0; SIGNAL_MODEL: nv_cap; TOL: 10%; VER: 2; XY: (-2700,4250); Value: 220NF 6.3V; CDS_SEC: 1; CHIPS_PART_NAME: C; MAT: X5R; MAX_VOLTAGE: 6.3V; SEC: 1; Part Type: 陶瓷电容; PCB Footprint: C0201
C137 = C: SMD  0201  220NF  6.3V  X5R  ±20%  ROHS; PARTS: 1; Part Reference: C137; Part Number: A1C01.00128; CDS_PHYS_PART_NAME: C_0402-0.22UF,X5R,10%,6.3V,039-0011-000-0.22UF,039-0011-000; CDS_PART_NAME: C_0402-0.22UF,X5R,10%,6.3V,039-0011-000; OriginalSymbolOrigin: (0,30); PKG_TYPE: CAP2-100-250; LEVEL: STD; PINSWAP: (A,B); XY: (-3150,4300); VER: 2; TOL: 10%; SIGNAL_MODEL: nv_cap; ROT: 0; PHYS_PAGE: 21; PATH: I24; PACK_TYPE: 402; NV_PN: 039-0011-000; DRAWING: #NAME?; DEVICE_TYPENAME: C_0402-022UFX5R1063V039-0011-000-022UF039-0011-000; CDS_LIB: discrete; ASSEMBLY: M2_NVME; Value: 220NF 6.3V; Part Type: 陶瓷电容; SEC: 1; MAX_VOLTAGE: 6.3V; MAT: X5R; CHIPS_PART_NAME: C; CDS_SEC: 1; PCB Footprint: C0201
C138 = C: SMD  0201  220NF  6.3V  X5R  ±20%  ROHS; PARTS: 1; Part Reference: C138; Part Number: A1C01.00128; CDS_PHYS_PART_NAME: C_0402-0.22UF,X5R,10%,6.3V,039-0011-000-0.22UF,039-0011-000; CDS_PART_NAME: C_0402-0.22UF,X5R,10%,6.3V,039-0011-000; OriginalSymbolOrigin: (0,30); PKG_TYPE: CAP2-100-250; LEVEL: STD; PINSWAP: (A,B); XY: (-3150,4000); VER: 2; TOL: 10%; SIGNAL_MODEL: nv_cap; ROT: 0; PHYS_PAGE: 21; PATH: I32; PACK_TYPE: 402; NV_PN: 039-0011-000; DRAWING: #NAME?; DEVICE_TYPENAME: C_0402-022UFX5R1063V039-0011-000-022UF039-0011-000; CDS_LIB: discrete; ASSEMBLY: M2_NVME; Value: 220NF 6.3V; Part Type: 陶瓷电容; SEC: 1; MAX_VOLTAGE: 6.3V; MAT: X5R; CHIPS_PART_NAME: C; CDS_SEC: 1; PCB Footprint: C0201
C139 = C: SMD  0201  220NF  6.3V  X5R  ±20%  ROHS; PARTS: 1; Part Reference: C139; CDS_PART_NAME: C_0402-0.22UF,X5R,10%,6.3V,039-0011-000; CDS_PHYS_PART_NAME: C_0402-0.22UF,X5R,10%,6.3V,039-0011-000-0.22UF,039-0011-000; Part Number: A1C01.00128; OriginalSymbolOrigin: (0,30); PKG_TYPE: CAP2-100-250; LEVEL: STD; PINSWAP: (A,B); ASSEMBLY: M2_NVME; CDS_LIB: discrete; DEVICE_TYPENAME: C_0402-022UFX5R1063V039-0011-000-022UF039-0011-000; DRAWING: #NAME?; NV_PN: 039-0011-000; PACK_TYPE: 402; PATH: I21; PHYS_PAGE: 21; ROT: 0; SIGNAL_MODEL: nv_cap; TOL: 10%; VER: 2; XY: (-2700,3950); Value: 220NF 6.3V; CDS_SEC: 1; CHIPS_PART_NAME: C; MAT: X5R; MAX_VOLTAGE: 6.3V; SEC: 1; Part Type: 陶瓷电容; PCB Footprint: C0201
C140 = C: SMD  0402  100NF  10V  X5R  ±10%  ROHS; PARTS: 1; Part Reference: C140; Part Number: A1C01.00163; OriginalSymbolOrigin: (0,30); PKG_TYPE: CAP2-100-250; LEVEL: STD; PINSWAP: (A,B); Value: 100NF 10V; Part Type: 陶瓷电容; PCB Footprint: C0402
C141 = C: SMD  0201  220NF  6.3V  X5R  ±20%  ROHS; PARTS: 1; Part Reference: C141; Part Number: A1C01.00128; CDS_PHYS_PART_NAME: C_0402-0.22UF,X5R,10%,6.3V,039-0011-000-0.22UF,039-0011-000; CDS_PART_NAME: C_0402-0.22UF,X5R,10%,6.3V,039-0011-000; OriginalSymbolOrigin: (0,30); PKG_TYPE: CAP2-100-250; LEVEL: STD; PINSWAP: (A,B); XY: (-3150,3700); VER: 2; TOL: 10%; SIGNAL_MODEL: nv_cap; ROT: 0; PHYS_PAGE: 21; PATH: I30; PACK_TYPE: 402; NV_PN: 039-0011-000; DRAWING: #NAME?; DEVICE_TYPENAME: C_0402-022UFX5R1063V039-0011-000-022UF039-0011-000; CDS_LIB: discrete; ASSEMBLY: M2_NVME; Value: 220NF 6.3V; Part Type: 陶瓷电容; SEC: 1; MAX_VOLTAGE: 6.3V; MAT: X5R; CHIPS_PART_NAME: C; CDS_SEC: 1; PCB Footprint: C0201
C142 = C: SMD  0201  220NF  6.3V  X5R  ±20%  ROHS; PARTS: 1; Part Reference: C142; CDS_PART_NAME: C_0402-0.22UF,X5R,10%,6.3V,039-0011-000; CDS_PHYS_PART_NAME: C_0402-0.22UF,X5R,10%,6.3V,039-0011-000-0.22UF,039-0011-000; Part Number: A1C01.00128; OriginalSymbolOrigin: (0,30); PKG_TYPE: CAP2-100-250; LEVEL: STD; PINSWAP: (A,B); ASSEMBLY: M2_NVME; CDS_LIB: discrete; DEVICE_TYPENAME: C_0402-022UFX5R1063V039-0011-000-022UF039-0011-000; DRAWING: #NAME?; NV_PN: 039-0011-000; PACK_TYPE: 402; PATH: I22; PHYS_PAGE: 21; ROT: 0; SIGNAL_MODEL: nv_cap; TOL: 10%; VER: 2; XY: (-2700,3650); Value: 220NF 6.3V; CDS_SEC: 1; CHIPS_PART_NAME: C; MAT: X5R; MAX_VOLTAGE: 6.3V; SEC: 1; Part Type: 陶瓷电容; PCB Footprint: C0201
C143 = C: SMD  0201  220NF  6.3V  X5R  ±20%  ROHS; PARTS: 1; Part Reference: C143; Part Number: A1C01.00128; CDS_PHYS_PART_NAME: C_0402-0.22UF,X5R,10%,6.3V,039-0011-000-0.22UF,039-0011-000; CDS_PART_NAME: C_0402-0.22UF,X5R,10%,6.3V,039-0011-000; OriginalSymbolOrigin: (0,30); PKG_TYPE: CAP2-100-250; LEVEL: STD; PINSWAP: (A,B); XY: (-2700,3350); VER: 2; TOL: 10%; SIGNAL_MODEL: nv_cap; ROT: 0; PHYS_PAGE: 21; PATH: I23; PACK_TYPE: 402; NV_PN: 039-0011-000; DRAWING: #NAME?; DEVICE_TYPENAME: C_0402-022UFX5R1063V039-0011-000-022UF039-0011-000; CDS_LIB: discrete; ASSEMBLY: M2_NVME; Value: 220NF 6.3V; Part Type: 陶瓷电容; SEC: 1; MAX_VOLTAGE: 6.3V; MAT: X5R; CHIPS_PART_NAME: C; CDS_SEC: 1; PCB Footprint: C0201
C144 = C: SMD  0201  220NF  6.3V  X5R  ±20%  ROHS; PARTS: 1; Part Reference: C144; Part Number: A1C01.00128; CDS_PHYS_PART_NAME: C_0402-0.22UF,X5R,10%,6.3V,039-0011-000-0.22UF,039-0011-000; CDS_PART_NAME: C_0402-0.22UF,X5R,10%,6.3V,039-0011-000; OriginalSymbolOrigin: (0,30); PKG_TYPE: CAP2-100-250; LEVEL: STD; PINSWAP: (A,B); XY: (-3150,3400); VER: 2; TOL: 10%; SIGNAL_MODEL: nv_cap; ROT: 0; PHYS_PAGE: 21; PATH: I31; PACK_TYPE: 402; NV_PN: 039-0011-000; DRAWING: #NAME?; DEVICE_TYPENAME: C_0402-022UFX5R1063V039-0011-000-022UF039-0011-000; CDS_LIB: discrete; ASSEMBLY: M2_NVME; Value: 220NF 6.3V; Part Type: 陶瓷电容; SEC: 1; MAX_VOLTAGE: 6.3V; MAT: X5R; CHIPS_PART_NAME: C; CDS_SEC: 1; PCB Footprint: C0201
H1007 = HOLE: Part Reference: H1007; PCB Footprint: HOLE_2D7_6D0_A; Priority: A; RK PN: HOLE_3R50; Value: HOLE_M2; Part Type: HOLE
J14 = M2_KEY_M: SMD  母座  75PIN  180度  M.2  M KEY  H4.2  0.5mm脚距  APC10359-P001A  黑色  LOTES  ROHS; Part Reference: J14; Part Number: A1J01.00017; Parameter: 连接器-比派-封装 M2_KEY_M; Value: M2_KEY_M; Part Type: 连接座; PCB Footprint: M2-M_KEY_SM_75_0D5
Q3 = MOSFET_NPN: SMD  编带  SOT-323  2SK3018  N沟道  长晶  ROHS; Part Reference: Q3; Part Number: A1D01.00007; Temp Coeff: -55℃ to ＋150℃; Value: 2SK3018; Part Type: 三极管-MOS管; PCB Footprint: SOT_323
Q27 = MOSFET_NPN: SMD  编带  SOT-323  2SK3018  N沟道  长晶  ROHS; Part Reference: Q27; Part Number: A1D01.00007; Temp Coeff: -55℃ to ＋150℃; Value: 2SK3018; Part Type: 三极管-MOS管; PCB Footprint: SOT_323
R61 = R: SMD  0201  33R  1/20W  ±1%  ROHS; Part Reference: R61; Part Number: A1R01.00137; PCB Footprint: R0201; Value: 33R 1%; Part Type: 贴片电阻
R62 = R: SMD  0201  10K  1/20W  ±5%  ROHS; Part Reference: R62; Part Number: A1R01.00012; PCB Footprint: R0201; Temp Coeff: －55℃ ~ ＋125℃; Value: 10K 5%; Part Type: 贴片电阻
R63 = R: SMD  0201  10K  1/20W  ±5%  ROHS; Part Reference: R63; Part Number: A1R01.00012; PCB Footprint: R0201; Temp Coeff: －55℃ ~ ＋125℃; Value: 10K 5%; Part Type: 贴片电阻
R64 = R: SMD  0201  10K  1/20W  ±5%  ROHS; Part Reference: R64; Part Number: A1R01.00012; PCB Footprint: R0201; Temp Coeff: －55℃ ~ ＋125℃; Value: 10K 5%; Part Type: 贴片电阻
R65 = R: SMD  0201  0R  1/20W  ±5%  ROHS; Part Reference: R65; Part Number: A1R01.00027; PCB Footprint: R0201; Temp Coeff: －55℃ ~ ＋125℃; Value: 0R 5%; Part Type: 贴片电阻
R66 = R: SMD  0201  0R  1/20W  ±5%  ROHS; Part Reference: R66; Part Number: A1R01.00027; PCB Footprint: R0201; Temp Coeff: －55℃ ~ ＋125℃; Value: 0R 5%; Part Type: 贴片电阻
R67 = R: SMD  0201  0R  1/20W  ±5%  ROHS; Part Reference: R67; Part Number: A1R01.00027; PCB Footprint: R0201; Temp Coeff: －55℃ ~ ＋125℃; Value: 0R 5%; Part Type: 贴片电阻
R156 = R: SMD  0402  47K  1/16W  ±1%  ROHS; Part Reference: R156; Part Number: A1R01.00248; CDS_PART_NAME: R_0402-47K,5 %,62.5MW,195-0599-000; CDS_PHYS_PART_NAME: R_0402-47K,5 %,62.5MW,195-0599-000-195-0599-000,47K; ASSEMBLY: M2_NVME; CDS_LIB: discrete; CDS_SEC: 1; DEVICE_TYPENAME: R_0402-47K5625MW195-0599-000-195-0599-00047K; DRAWING: #NAME?; MAX_WATTAGE: 62.5mW; NV_PN: 195-0599-000; PACK_TYPE: 402; PATH: I39; PHYS_PAGE: 21; ROT: 2; SIGNAL_MODEL: nv_res; TOL: 5%; XY: (-8000,4600); PCB Footprint: R0402; Value: NC/47K 1%; Part Type: 贴片电阻; CHIPS_PART_NAME: R; SKU: NO STUFF; VER: 2; SEC: 1
R158 = R: SMD  0402  0R  1/16W  ±1%  ROHS; Part Reference: R158; Part Number: A1R01.00219; PCB Footprint: R0402; Value: NC/0R 1%; Part Type: 贴片电阻
R159 = R: SMD  0402  0R  1/16W  ±1%  ROHS; Part Reference: R159; Part Number: A1R01.00219; PCB Footprint: R0402; Value: NC/0R 1%; Part Type: 贴片电阻
Y1 = OSC_4P_V: SMD  编带  有源  3225  32.768KHz  3.3V  ±10ppm  ROHS; Part Reference: Y1; Part Number: A1Y01.00030; PCB Footprint: OSC_SM4_3D2X2D5; Value: NC/32.768KHz 3.3V; Part Type: 晶振
*#18 = radxa_1010: Page Create Date: March  8, 1995; Page Size: =PageSize; Page Modify Date: =ModifiedDate